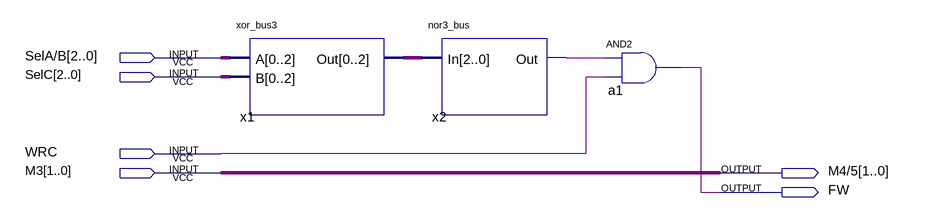
[diagram p0: schematic sheet]
// Quartus schematic op_forwarding1.bdf as structural Verilog: 3 symbols, 6 pins
module op_forwarding1 (
  input  [2:0] \SelA/B ,
  input  [2:0] SelC,
  input  WRC,
  input  [1:0] M3,
  output [1:0] \M4/5 ,
  output FW
);

  wire x2_out;
  wire [2:0] x1_out;

  xor_bus3 x1 (.A(\SelA/B ), .B(SelC), .Out(x1_out));
  nor3_bus x2 (.In(x1_out), .Out(x2_out));
  and a1 (FW, x2_out, WRC);

  assign \M4/5  = M3;
endmodule
